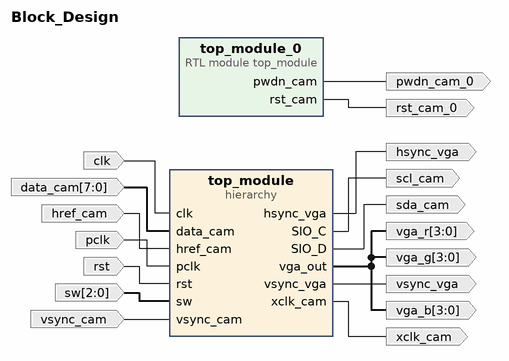
[diagram p0: block diagram of the top level]
# Vivado block design Block_Design, xc7a35tcpg236-1, Vivado 2025.2
create_bd_design Block_Design

create_bd_port -dir O pwdn_cam_0
create_bd_port -dir O rst_cam_0
create_bd_port -dir I -type rst rst
create_bd_port -dir I -type clk clk
create_bd_port -dir O scl_cam
create_bd_port -dir I -from 2 -to 0 sw
create_bd_port -dir O -from 3 -to 0 vga_r
create_bd_port -dir O -from 3 -to 0 vga_g
create_bd_port -dir O -from 3 -to 0 vga_b
create_bd_port -dir I pclk
create_bd_port -dir I vsync_cam
create_bd_port -dir I href_cam
create_bd_port -dir I -from 7 -to 0 data_cam
create_bd_port -dir O sda_cam
create_bd_port -dir O xclk_cam
create_bd_port -dir O hsync_vga
create_bd_port -dir O vsync_vga

create_bd_cell -type module -reference top_module top_module_0
create_bd_cell -type hier top_module

# ---- hierarchy /top_module ----
current_bd_instance /top_module
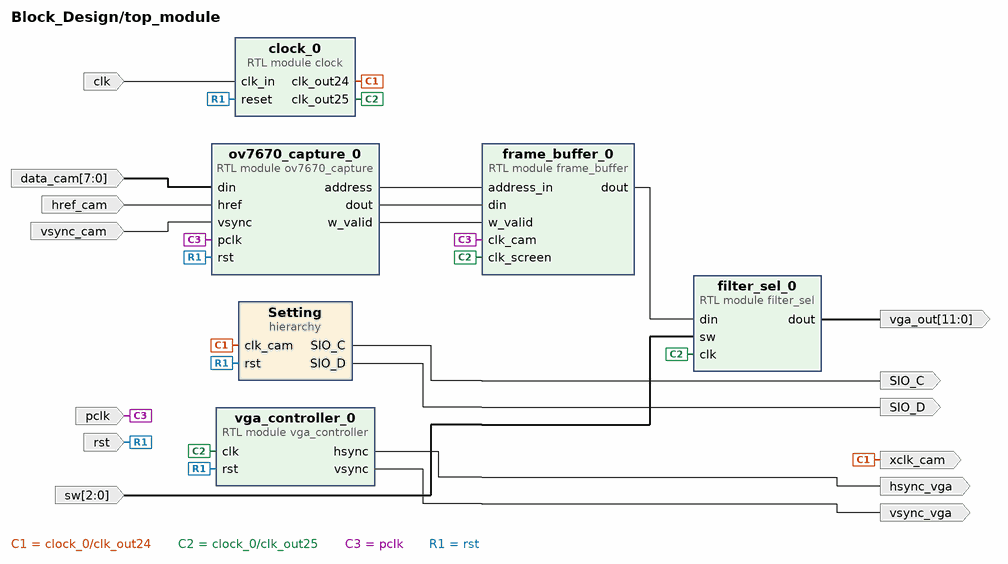
[diagram p1: block diagram inside /top_module]
create_bd_pin -dir O SIO_C
create_bd_pin -dir O SIO_D
create_bd_pin -dir I -type rst rst
create_bd_pin -dir I clk
create_bd_pin -dir I -from 2 -to 0 sw
create_bd_pin -dir O -from 11 -to 0 vga_out
create_bd_pin -dir I pclk
create_bd_pin -dir I vsync_cam
create_bd_pin -dir I href_cam
create_bd_pin -dir I -from 7 -to 0 data_cam
create_bd_pin -dir O xclk_cam
create_bd_pin -dir O hsync_vga
create_bd_pin -dir O vsync_vga

create_bd_cell -type hier Setting
create_bd_cell -type module -reference vga_controller vga_controller_0
create_bd_cell -type module -reference ov7670_capture ov7670_capture_0
create_bd_cell -type module -reference frame_buffer frame_buffer_0
create_bd_cell -type module -reference filter_sel filter_sel_0
create_bd_cell -type module -reference clock clock_0

# ---- hierarchy /top_module/Setting ----
current_bd_instance /top_module/Setting
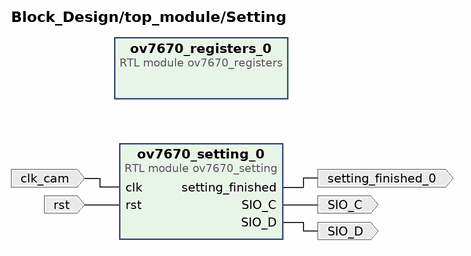
[diagram p2: block diagram inside /top_module/Setting]
create_bd_pin -dir O SIO_C
create_bd_pin -dir O SIO_D
create_bd_pin -dir I -type clk clk_cam
create_bd_pin -dir I -type rst rst
create_bd_pin -dir O setting_finished_0

create_bd_cell -type module -reference ov7670_registers ov7670_registers_0
create_bd_cell -type module -reference ov7670_setting ov7670_setting_0

# ---- connections ----

current_bd_instance /top_module
connect_bd_net [get_bd_pins Setting/SIO_C] [get_bd_pins SIO_C]
connect_bd_net [get_bd_pins Setting/SIO_D] [get_bd_pins SIO_D]
connect_bd_net -net clk_in_0_1 [get_bd_pins clk] [get_bd_pins clock_0/clk_in]
connect_bd_net [get_bd_pins clock_0/clk_out24] [get_bd_pins Setting/clk_cam] [get_bd_pins xclk_cam]
connect_bd_net [get_bd_pins clock_0/clk_out25] \
  [get_bd_pins filter_sel_0/clk] [get_bd_pins frame_buffer_0/clk_screen] [get_bd_pins vga_controller_0/clk]
connect_bd_net -net din_0_1 [get_bd_pins data_cam] [get_bd_pins ov7670_capture_0/din]
connect_bd_net [get_bd_pins filter_sel_0/dout] [get_bd_pins vga_out]
connect_bd_net [get_bd_pins frame_buffer_0/dout] [get_bd_pins filter_sel_0/din]
connect_bd_net -net href_0_1 [get_bd_pins href_cam] [get_bd_pins ov7670_capture_0/href]
connect_bd_net [get_bd_pins ov7670_capture_0/address] [get_bd_pins frame_buffer_0/address_in]
connect_bd_net [get_bd_pins ov7670_capture_0/dout] [get_bd_pins frame_buffer_0/din]
connect_bd_net [get_bd_pins ov7670_capture_0/w_valid] [get_bd_pins frame_buffer_0/w_valid]
connect_bd_net -net pclk_1_1 [get_bd_pins pclk] [get_bd_pins ov7670_capture_0/pclk] [get_bd_pins frame_buffer_0/clk_cam]
connect_bd_net -net rst_0_1 [get_bd_pins rst] \
  [get_bd_pins Setting/rst] [get_bd_pins clock_0/reset] [get_bd_pins ov7670_capture_0/rst] [get_bd_pins vga_controller_0/rst]
connect_bd_net -net sw_1_1 [get_bd_pins sw] [get_bd_pins filter_sel_0/sw]
connect_bd_net [get_bd_pins vga_controller_0/hsync] [get_bd_pins hsync_vga]
connect_bd_net [get_bd_pins vga_controller_0/vsync] [get_bd_pins vsync_vga]
connect_bd_net -net vsync_cam_1_1 [get_bd_pins vsync_cam] [get_bd_pins ov7670_capture_0/vsync]

current_bd_instance /top_module/Setting
connect_bd_net -net clk_0_1 [get_bd_pins clk_cam] [get_bd_pins ov7670_setting_0/clk]
connect_bd_net [get_bd_pins ov7670_setting_0/SIO_C] [get_bd_pins SIO_C]
connect_bd_net [get_bd_pins ov7670_setting_0/SIO_D] [get_bd_pins SIO_D]
connect_bd_net [get_bd_pins ov7670_setting_0/setting_finished] [get_bd_pins setting_finished_0]
connect_bd_net -net rst_0_1 [get_bd_pins rst] [get_bd_pins ov7670_setting_0/rst]

current_bd_instance /
connect_bd_net -net Top_SIO_C_0 [get_bd_pins top_module/SIO_C] [get_bd_ports scl_cam]
connect_bd_net -net Top_SIO_D [get_bd_pins top_module/SIO_D] [get_bd_ports sda_cam]
connect_bd_net -net Top_dout_0 [get_bd_pins top_module/vga_out] [get_bd_ports vga_r] [get_bd_ports vga_g] [get_bd_ports vga_b]
connect_bd_net -net Top_hsync_0 [get_bd_pins top_module/hsync_vga] [get_bd_ports hsync_vga]
connect_bd_net -net Top_vsync_0 [get_bd_pins top_module/vsync_vga] [get_bd_ports vsync_vga]
connect_bd_net -net Top_xclk_cam_1 [get_bd_pins top_module/xclk_cam] [get_bd_ports xclk_cam]
connect_bd_net -net clk_1_1 [get_bd_ports clk] [get_bd_pins top_module/clk]
connect_bd_net -net din_0_1 [get_bd_ports data_cam] [get_bd_pins top_module/data_cam]
connect_bd_net -net href_0_1 [get_bd_ports href_cam] [get_bd_pins top_module/href_cam]
connect_bd_net -net pclk_1_1 [get_bd_ports pclk] [get_bd_pins top_module/pclk]
connect_bd_net -net rst_1_1 [get_bd_ports rst] [get_bd_pins top_module/rst]
connect_bd_net -net sw_1_1 [get_bd_ports sw] [get_bd_pins top_module/sw]
connect_bd_net [get_bd_pins top_module_0/pwdn_cam] [get_bd_ports pwdn_cam_0]
connect_bd_net [get_bd_pins top_module_0/rst_cam] [get_bd_ports rst_cam_0]
connect_bd_net -net vsync_cam_1_1 [get_bd_ports vsync_cam] [get_bd_pins top_module/vsync_cam]

validate_bd_design
save_bd_design
